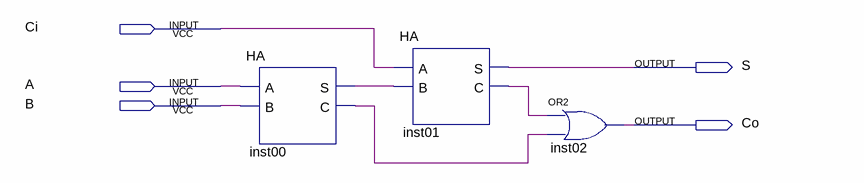
[diagram p0: schematic sheet]
// Quartus schematic FA.bdf as structural Verilog: 3 symbols, 5 pins
module FA (
  input  Ci,
  input  A,
  input  B,
  output S,
  output Co
);

  wire inst00_c, inst00_s, inst01_c;

  HA inst00 (.A(A), .B(B), .S(inst00_s), .C(inst00_c));
  HA inst01 (.A(Ci), .B(inst00_s), .S(S), .C(inst01_c));
  or inst02 (Co, inst01_c, inst00_c);
endmodule
